# EAGLE design working (EAGLE 5.10)
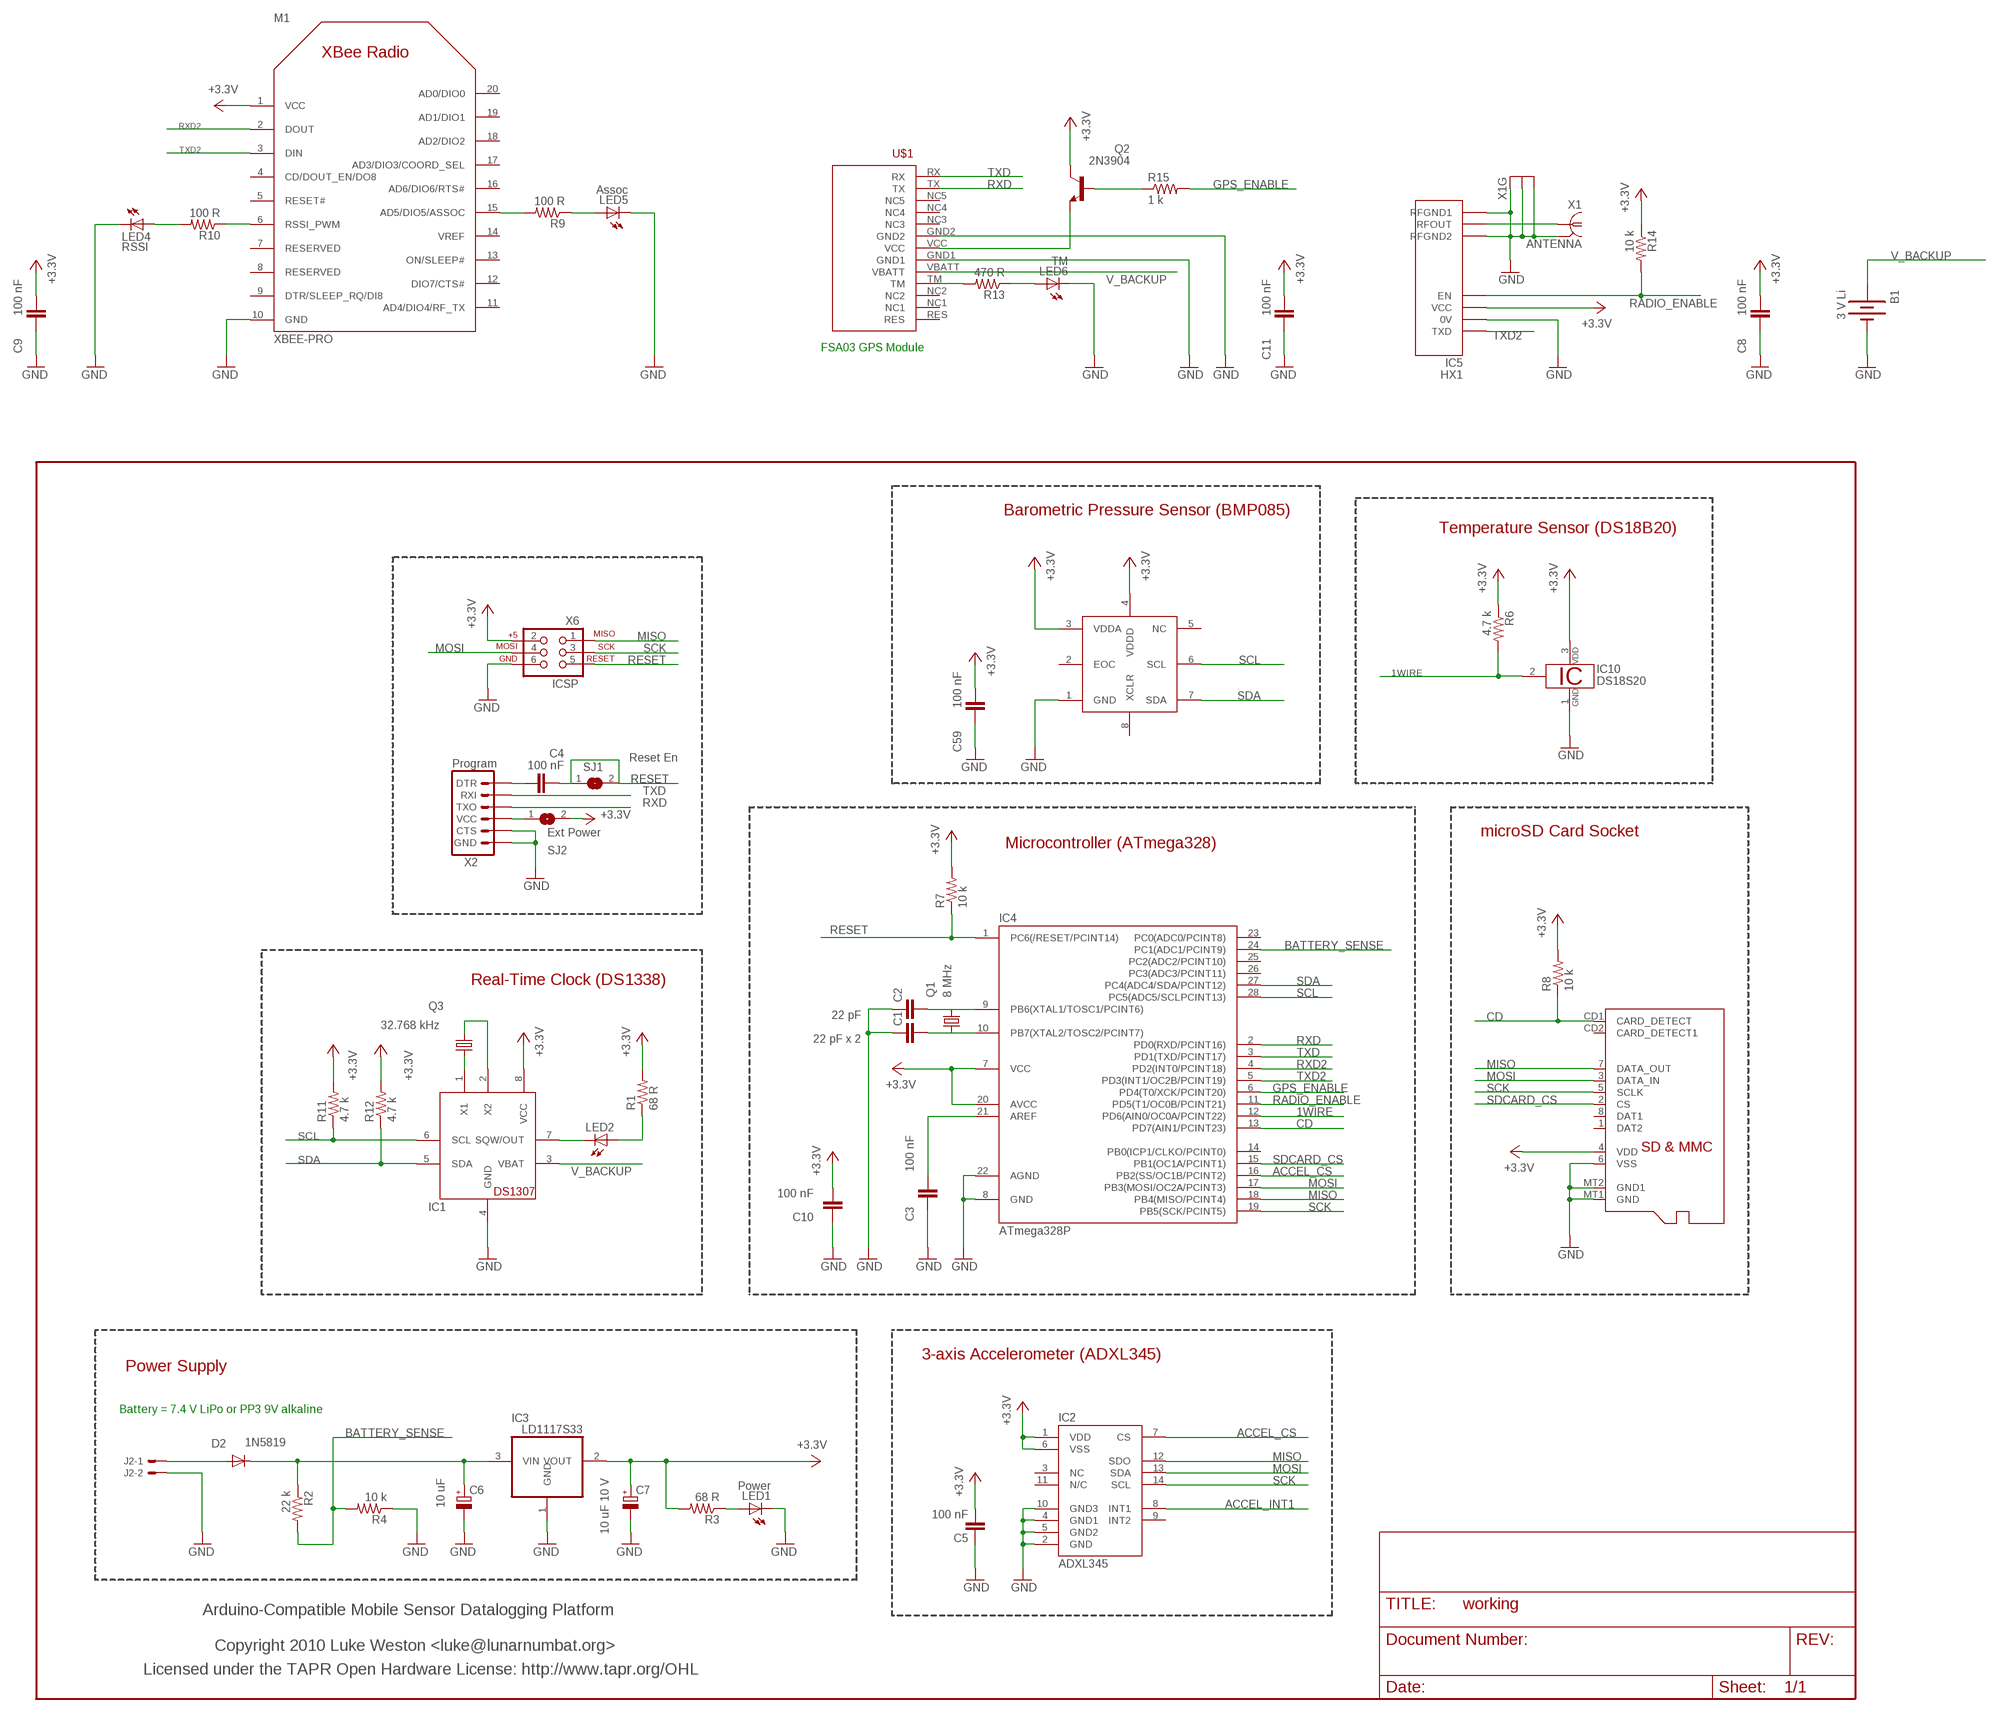
[diagram p0: schematic, sheet 1]

## Parts
B1  3 V Li  BATTERY12PTH  [BATTCON_12MM_PTH]
C1  22 pF x 2  C-EU025-024X044  [C025-024X044]
C2  22 pF  C-EU025-024X044  [C025-024X044]
C3  100 nF  C-EU025-025X050  [C025-025X050]
C4  100 nF  C-EU025-025X050  [C025-025X050]
C5  100 nF  C-EU025-025X050  [C025-025X050]
C6  10 uF  CPOL-EUE2.5-7  [E2,5-7]
C7  10 uF 10 V  CPOL-EUE2.5-7  [E2,5-7]
C8  100 nF  C-EU025-025X050  [C025-025X050]
C9  100 nF  C-EU025-025X050  [C025-025X050]
C10  100 nF  C-EU025-025X050  [C025-025X050]
C11  100 nF  C-EU025-025X050  [C025-025X050]
C59  100 nF  C-EU025-025X050  [C025-025X050]
D2  1N5819  DIODE-DO35-10  [DO35-10]
IC1  DS1338  DS1307  [DIL08]
IC2  ADXL345  [LGA14]
IC3  LD1117S33  REG1117  [SOT223]
IC4  ATmega328P  ATMEGA48/88/168-PU  [DIL28-3]
IC5  HX1  [HX1]
IC6  BMP085  [BMP085]
IC10  DS18S20  [TO92-]
J2  22-23-2021  [22-23-2021]
LED1  Power  LED3MM  [LED3MM]
LED2  LED3MM  [LED3MM]
LED4  RSSI  LED3MM  [LED3MM]
LED5  Assoc  LED3MM  [LED3MM]
LED6  TM  LED3MM  [LED3MM]
M1  XBEE-PRO  [XBEE-PRO]
Q1  8 MHz  CRYSTALHC49UV  [HC49U-V]
Q2  2N3904  [TO92]
Q3  32.768 kHz  CRYSTALTC38H  [TC38H]
R1  68 R  R-US_FLIPFLOP  [0805-THM]
R2  22 k  R-US_FLIPFLOP  [0805-THM]
R3  68 R  R-US_FLIPFLOP  [0805-THM]
R4  10 k  R-US_FLIPFLOP  [0805-THM]
R6  4.7 k  R-US_FLIPFLOP  [0805-THM]
R7  10 k  R-US_FLIPFLOP  [0805-THM]
R8  10 k  R-US_FLIPFLOP  [0805-THM]
R9  100 R  R-US_FLIPFLOP  [0805-THM]
R10  100 R  R-US_FLIPFLOP  [0805-THM]
R11  4.7 k  R-US_FLIPFLOP  [0805-THM]
R12  4.7 k  R-US_FLIPFLOP  [0805-THM]
R13  470 R  R-US_FLIPFLOP  [0805-THM]
R14  10 k  R-US_FLIPFLOP  [0805-THM]
R15  1 k  R-US_0207/2V  [0207/2V]
SJ1  Reset En  SJ  [SJ]
SJ2  Ext Power  SJ  [SJ]
U$1  FSA03  [FSA03]
U$2  MICROSD  [MICROSD]
X1  ANTENNA  LTI-SASF54GT  [LTI-SASF54GT]
X2  Program  ARDUINO_SERIAL_PROGRAMLONGPADS  [1X06_LONGPADS]
X6  ICSP  AVR_SPI_PRG_6PTH  [2X3]

## Nets
1WIRE: IC4.12(PD6(AIN0/OC0A/PCINT22)) IC10.2 R6.2
+3V3: C5.2 C7.+ C8.2 C9.2 C10.2 C11.2 C59.2 IC1.8(VCC) IC2.1(VDD) IC2.6(VSS) IC3.2(VOUT) IC4.7(VCC) IC4.20(AVCC) IC5.VCC IC6.3(VDDA) IC6.4(VDDD) IC10.3 M1.1(VCC) Q2.1(C) R1.2 R3.2 R6.1 R7.2 R8.2 R11.2 R12.2 R14.1 SJ2.2 U$2.4(VDD) X6.2 ; supply symbol labelled +3.3V
ACCEL_CS: IC2.7(CS) IC4.16(PB2(SS/OC1B/PCINT2))
ACCEL_INT1: IC2.8(INT1)
BATTERY_SENSE: IC4.24(PC1(ADC1/PCINT9)) R2.2 R4.2
CD: IC4.13(PD7(AIN1/PCINT23)) R8.1 U$2.CD1(CARD_DETECT)
GND: B1.GND(-) C1.1 C2.1 C3.1 C5.1 C6.- C7.- C8.1 C9.1 C10.1 C11.1 C59.1 IC1.4(GND) IC2.2(GND) IC2.4(GND1) IC2.5(GND2) IC2.10(GND3) IC3.1(GND) IC4.8(GND) IC4.22(AGND) IC5.0V IC5.RFGND1 IC5.RFGND2 IC6.1(GND) IC10.1 J2.2 LED1.K(C) LED4.K(C) LED5.K(C) M1.10(GND) R4.1 U$2.6(VSS) U$2.MT1(GND) U$2.MT2(GND1) X1.2(GND) X1.3(GND) X1.4(GND) X1.5(GND) X2.5(CTS) X2.6(GND) X6.6
GPS_ENABLE: IC4.6(PD4(T0/XCK/PCINT20)) R15.2
MISO: IC2.12(SDO) IC4.18(PB4(MISO/PCINT4)) U$2.7(DATA_OUT) X6.1
MOSI: IC2.13(SDA) IC4.17(PB3(MOSI/OC2A/PCINT3)) U$2.3(DATA_IN) X6.4
N$1: C2.2 IC4.9(PB6(XTAL1/TOSC1/PCINT6)) Q1.2
N$2: C1.2 IC4.10(PB7(XTAL2/TOSC2/PCINT7)) Q1.1
N$3: C3.2 IC4.21(AREF)
N$4: C4.2 X2.1(DTR)
N$5: Q2.3(E) U$1.VCC
N$6: C6.+ D2.C IC3.3(VIN) R2.1
N$7: SJ2.1 X2.4(VCC)
N$8: LED1.A R3.1
N$9: D2.A J2.1
N$10: IC1.2(X2) Q3.1
N$11: IC1.1(X1) Q3.2
N$12: IC1.7(SQW/OUT) LED2.K(C)
N$13: LED2.A R1.1
N$14: R13.2 U$1.TM
N$15: IC5.RFOUT X1.1
N$16: M1.15(AD5/DIO5/ASSOC) R9.2
N$17: Q2.2(B) R15.1
N$19: M1.6(RSSI_PWM) R10.1
N$20: LED6.A R13.1
N$21: LED4.A R10.2
N$22: LED5.A R9.1
N$36: LED6.K(C) U$1.GND1 U$1.GND2 ; supply symbol labelled GND
RADIO_ENABLE: IC4.11(PD5(T1/OC0B/PCINT21)) IC5.EN R14.2
RESET: C4.1 IC4.1(PC6(/RESET/PCINT14)) R7.1 SJ1.1 SJ1.2 X6.5
RXD: IC4.2(PD0(RXD/PCINT16)) U$1.TX X2.3(TXO)
RXD2: IC4.4(PD2(INT0/PCINT18)) M1.2(DOUT)
SCK: IC2.14(SCL) IC4.19(PB5(SCK/PCINT5)) U$2.5(SCLK) X6.3
SCL: IC1.6(SCL) IC4.28(PC5(ADC5/SCLPCINT13)) IC6.6(SCL) R11.1
SDA: IC1.5(SDA) IC4.27(PC4(ADC4/SDA/PCINT12)) IC6.7(SDA) R12.1
SDCARD_CS: IC4.15(PB1(OC1A/PCINT1)) U$2.2(CS)
TXD: IC4.3(PD1(TXD/PCINT17)) U$1.RX X2.2(RXI)
TXD2: IC4.5(PD3(INT1/OC2B/PCINT19)) IC5.TXD M1.3(DIN)
V_BACKUP: B1.VCC@1(+) IC1.3(VBAT) U$1.VBATT
Unconnected: IC2.3(NC) IC2.9(INT2) IC2.11(N/C) IC4.14(PB0(ICP1/CLKO/PCINT0)) IC4.23(PC0(ADC0/PCINT8)) IC4.25(PC2(ADC2/PCINT10)) IC4.26(PC3(ADC3/PCINT11)) IC6.2(EOC) IC6.5(NC) IC6.8(XCLR) M1.4(CD/DOUT_EN/DO8) M1.5(RESET#) M1.7(RESERVED) M1.8(RESERVED) M1.9(DTR/SLEEP_RQ/DI8) M1.11(AD4/DIO4/RF_TX) M1.12(DIO7/CTS#) M1.13(ON/SLEEP#) M1.14(VREF) M1.16(AD6/DIO6/RTS#) M1.17(AD3/DIO3/COORD_SEL) M1.18(AD2/DIO2) M1.19(AD1/DIO1) M1.20(AD0/DIO0) U$1.NC1 U$1.NC2 U$1.NC3 U$1.NC4 U$1.NC5 U$1.RES U$2.1(DAT2) U$2.8(DAT1) U$2.CD2(CARD_DETECT1)

## Notes on the sheet
- FSA03 GPS Module
- Barometric Pressure Sensor (BMP085)
- Temperature Sensor (DS18B20)
- microSD Card Socket
- Microcontroller (ATmega328)
- Real-Time Clock (DS1338)
- 3-axis Accelerometer (ADXL345)
- Power Supply
- Battery = 7.4 V LiPo or PP3 9V alkaline
- Arduino-Compatible Mobile Sensor Datalogging Platform
- Copyright 2010 Luke Weston <luke@lunarnumbat.org>
- Licensed under the TAPR Open Hardware License: http://www.tapr.org/OHL

## Library data of the parts
B1 = SparkFun:BATTERY: Battery Holders Various common sizes : AA, AAA, 20mm coin cell and 12mm coin cell.
C1-C5 C8-C11 C59 = rcl:C-EU: CAPACITOR, European symbol
C6 C7 = rcl:CPOL-EU: POLARIZED CAPACITOR, European symbol
D2 = diode:DIODE-: DIODE
IC1 = adafruit:DS1307: DS1307 Real time clock (RTC) with battery backup ability. Talk to it via i2c
IC2 = SparkFun:ADXL345
IC3 = burr-brown:REG1117: 800mA and 1A Low Dropout (LDO) Positive Regulator 1.8V, 2.5V, 2.85V, 3.3V, 5V, and Adj
IC4 = atmega8:ATMEGA48/88/168-PU
IC5 = trackuino:HX1
IC6 = SparkFun:BMP085
IC10 = 1wire:DS18S20: High Precision Digital Thermometer This chip provides a onewire thermosensor with approx. 0.5°C accuracy.A programmable over/undertemperure alarm is available. Notes: Vdd must be applied for accurate measurements at low temperatures, as the parasite power circuit otherwise heats the sensor. If parasite power is used, Vdd has to be connected to GND. The DS1822 is a low-cost thermometer chip, the DS18B20 is similar to the DS18S20, but with 9..12 Bit programmable precision. Author: Jan Kandziora <jjj@gmx.de>
J2 = con-molex:22-23-2021: .100" (2.54mm) Center Header - 2 Pin
LED1 LED2 LED4-LED6 = led:LED: LED OSRAM: - CHIPLED LG R971, LG N971, LY N971, LG Q971, LY Q971, LO R971, LY R971 LH N974, LH R974 LS Q976, LO Q976, LY Q976 LO Q996 - Hyper CHIPLED LW Q18S LB Q993, LB Q99A, LB R99A - SideLED LS A670, LO A670, LY A670, LG A670, LP A670 LB A673, LV A673, LT A673, LW A673 LH A674 LY A675 LS A676, LA A676, LO A676, LY A676, LW A676 LS A679, LY A679, LG A679 - Hyper Micro SIDELED® LS Y876, LA Y876, LO Y876, LY Y876 LT Y87S - SmartLED LW L88C, LW L88S LB L89C, LB L89S, LG L890 LS L89K, LO L89K, LY L89K LS L896, LA L896, LO L896, LY L896 - TOPLED LS T670, LO T670, LY T670, LG T670, LP T670 LSG T670, LSP T670, LSY T670, LOP T670, LYG T670 LG T671, LOG T671, LSG T671 LB T673, LV T673, LT T673, LW T673 LH T674 LS T676, LA T676, LO T676, LY T676, LB T676, LH T676, LSB T676, LW T676 LB T67C, LV T67C, LT T67C, LS T67K, LO T67K, LY T67K, LW E67C LS E67B, LA E67B, LO E67B, LY E67B, LB E67C, LV E67C, LT E67C LW T67C LS T679, LY T679, LG T679 LS T770, LO T770, LY T770, LG T770, LP T770 LB T773, LV T773, LT T773, LW T773 LH T774 LS E675, LA E675, LY E675, LS T675 LS T776, LA T776, LO T776, LY T776, LB T776 LHGB T686 LT T68C, LB T68C - Hyper Mini TOPLED® LB M676 - Mini TOPLED Santana® LG M470 LS M47K, LO M47K, LY M47K Source: http://www.osram.convergy.de - LUMILED® LXK2-PW12-R00, LXK2-PW12-S00, LXK2-PW14-U00, LXK2-PW14-V00 LXK2-PM12-R00, LXK2-PM12-S00, LXK2-PM14-U00 LXK2-PE12-Q00, LXK2-PE12-R00, LXK2-PE12-S00, LXK2-PE14-T00, LXK2-PE14-U00 LXK2-PB12-K00, LXK2-PB12-L00, LXK2-PB12-M00, LXK2-PB14-N00, LXK2-PB14-P00, LXK2-PB14-Q00 LXK2-PR12-L00, LXK2-PR12-M00, LXK2-PR14-Q00, LXK2-PR14-R00 LXK2-PD12-Q00, LXK2-PD12-R00, LXK2-PD12-S00 LXK2-PH12-R00, LXK2-PH12-S00 LXK2-PL12-P00, LXK2-PL12-Q00, LXK2-PL12-R00 Source: www.luxeon.com
M1 = xbee_r1:XBEE
Q1 = SparkFun:CRYSTAL: Crystals Various standard crystals. Proven footprints. Spark Fun Electronics SKU : COM-00534
Q2 = transistor:2N3904: NPN TRANSISTOR
Q3 = crystal:CRYSTAL: CRYSTAL
R1-R4 R6-R15 = adafruit:R-US_: RESISTOR, American symbol
SJ1 SJ2 = jumper:SJ: SMD solder JUMPER
U$1 = FSA03:FSA03: Falcom FSA03 surface mount GPS with ublox chipset, part created by Landon Cox, ESawdust.com
U$2 = adafruit:MICROSD: Micro-SD / Transflash card holder with SPI pinout For the 3M # 2908-05WB-MG and/or 4UCON #19656 push-push type
X1 = con-coax:LTI-SASF54GT: SMA vertical PCB thrue hole jack Source: Lighthorse Technologies, inc. SASF54GT.pdf
X2 = SparkFun:ARDUINO_SERIAL_PROGRAM
X6 = SparkFun:AVR_SPI_PRG_6: AVR ISP 6 Pin This is the reduced ISP connector for AVR programming. Common on Arduino. This footprint will take up less PCB space and can be used with a 10-pin to 6-pin adapter such as SKU: BOB-08508

## Net classes
1 vcc: width 0.254 mm

## Board
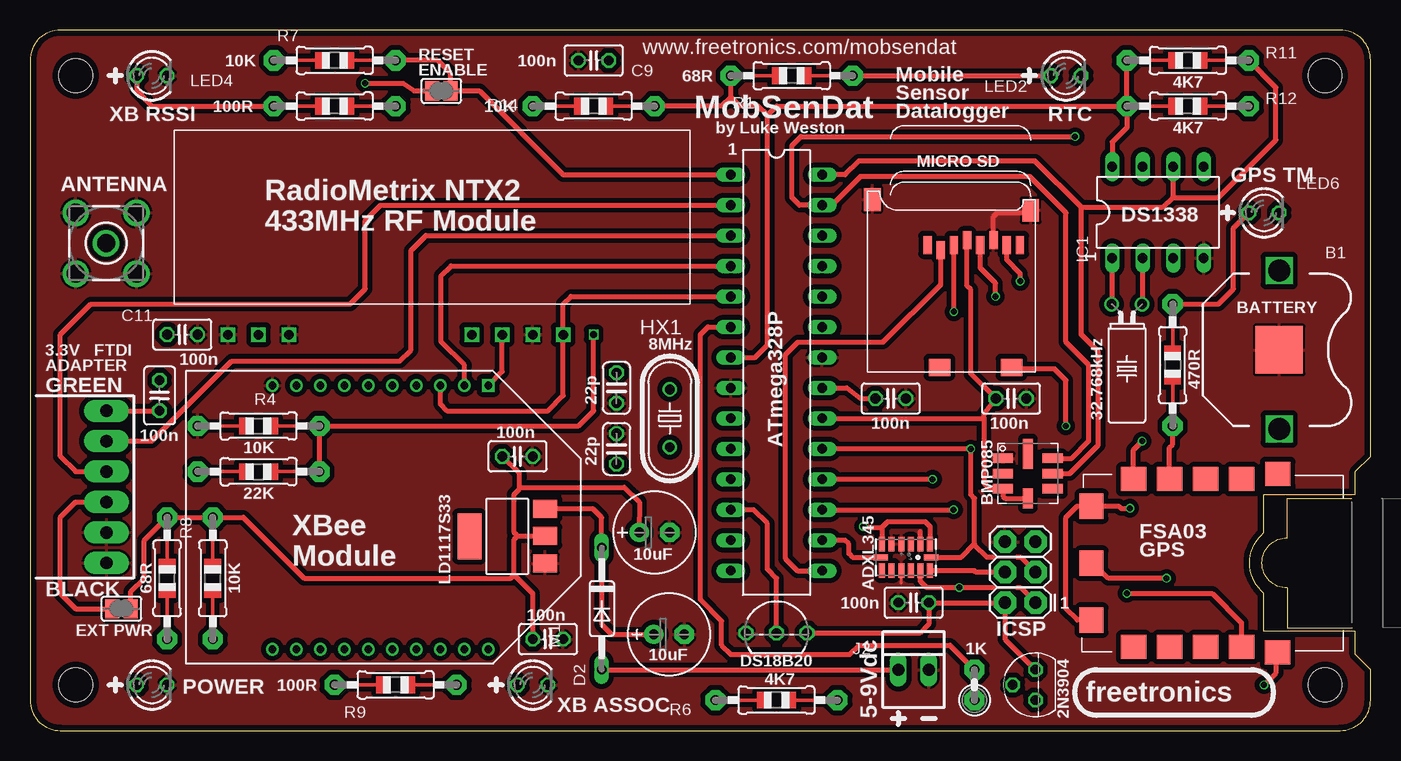
[diagram p1: board, top side]
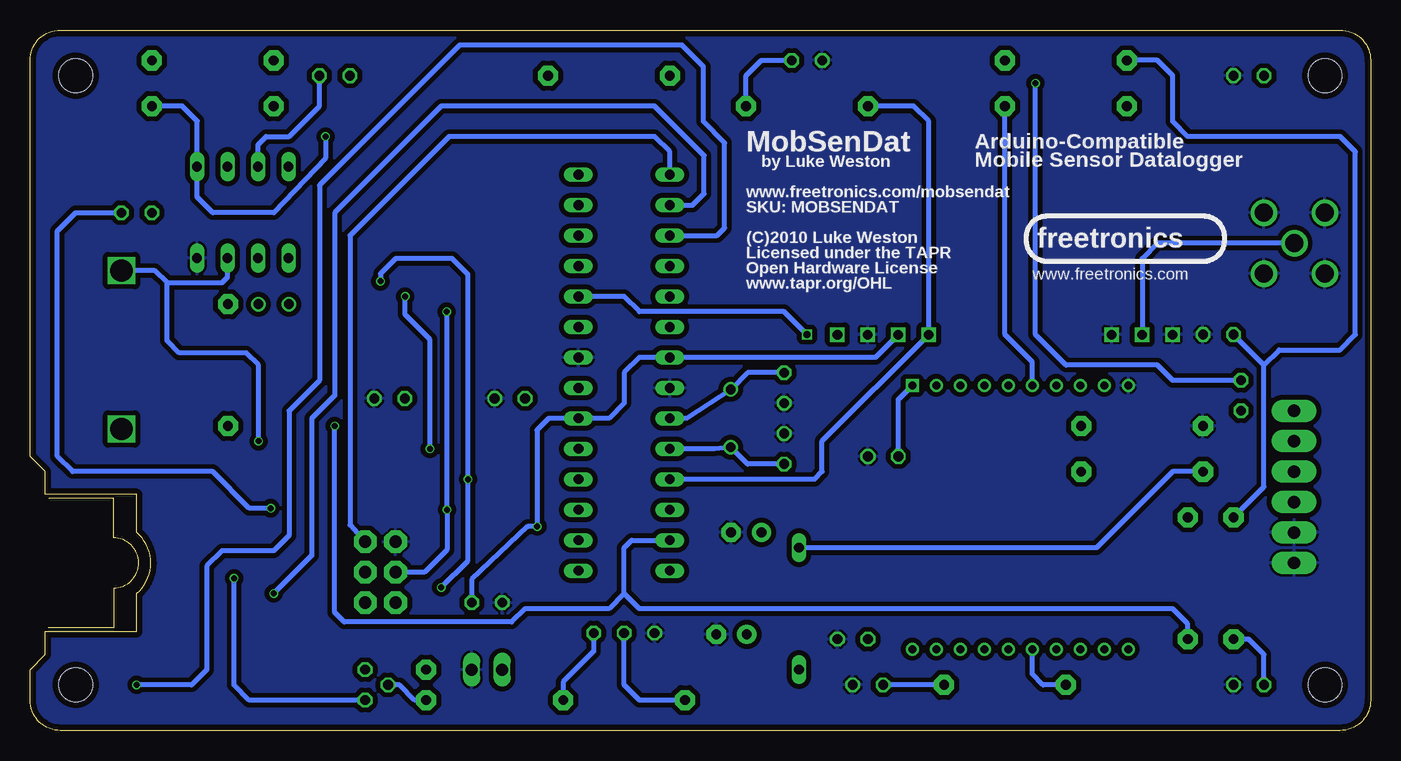
[diagram p2: board, bottom side, seen from below]

Size 111.76 x 58.42 mm. Coordinates in mm from the lower left corner, seen from the top.
Outline: 2.54,0 109.22,0 arc90 111.76,2.54 111.76,5.08 110.49,6.35 110.49,8.26 102.87,8.26 102.87,11.43 arc-100 102.87,16.51 102.87,19.68 110.49,19.68 110.49,21.59 111.76,22.86 111.76,55.88 arc90 109.22,58.42 2.54,58.42 arc90 0,55.88 0,2.54 arc90 2.54,0
Copper layers (1*16): Top 0.035mm / dielectric 1.5mm / Bottom 0.035mm
Design rules "PCBCart-.3mmHoles-.1mmAnnulars": minimum track width 8mil, minimum drill 0.3mm, track to track 8mil, track to pad 8mil, pad to pad 8mil, via to via 8mil, smd to smd 8mil, copper to edge 20mil, drill to drill 8mil, minimum pad ring 8mil, minimum via ring 4mil, stop-mask expansion 3mil, vias tented up to drill 0mil, thermal gap 8mil
Holes 2.8 mm at 3.81,54.61 3.81,3.81 107.95,3.81 107.95,54.61

### Footprints (pad centres in the part's own frame; a part is rotated, then mirrored left to right if it is on the bottom)
BATTCON_12MM_PTH = smd 3.962 x 3.962: GND 0,0 | drill 1.854 square: VCC@1 -6.604,0; VCC@2 6.604,0
C025-024X044 = drill 0.813 octagon: 1 -1.27,0; 2 1.27,0
C025-025X050 = drill 0.813 octagon: 1 -1.27,0; 2 1.27,0
E2,5-7 = drill 0.813 pad 1.6 round: + -1.27,0 | drill 0.813 pad 1.6 octagon: - 1.27,0
DO35-10 = drill 0.813 long: A 5.08,0; C -5.08,0
DIL08 = drill 0.813 long: 1 -3.81,-3.81; 2 -1.27,-3.81; 3 1.27,-3.81; 4 3.81,-3.81; 5 3.81,3.81; 6 1.27,3.81; 7 -1.27,3.81; 8 -3.81,3.81
LGA14 = smd 0.5 x 1.2: 1 2,1.1; 2 1.2,1.1; 3 0.4,1.1; 4 -0.4,1.1; 5 -1.2,1.1; 6 -2,1.1; 8 -2,-1.1; 9 -1.2,-1.1; 10 -0.4,-1.1; 11 0.4,-1.1; 12 1.2,-1.1; 13 2,-1.1 | smd 1.2 x 0.5: 7 -2.1,0; 14 2.1,0
SOT223 = smd 1.499 x 2.007: 1 -2.261,-3.15; 2 0.025,-3.15; 3 2.311,-3.15 | smd 3.81 x 2.007: 4 0,3.15
DIL28-3 = drill 0.813 long: 1 -16.51,-3.81; 2 -13.97,-3.81; 3 -11.43,-3.81; 4 -8.89,-3.81; 5 -6.35,-3.81; 6 -3.81,-3.81; 7 -1.27,-3.81; 8 1.27,-3.81; 9 3.81,-3.81; 10 6.35,-3.81; 11 8.89,-3.81; 12 11.43,-3.81; 13 13.97,-3.81; 14 16.51,-3.81; 15 16.51,3.81; 16 13.97,3.81; 17 11.43,3.81; 18 8.89,3.81; 19 6.35,3.81; 20 3.81,3.81; 21 1.27,3.81; 22 -1.27,3.81; 23 -3.81,3.81; 24 -6.35,3.81; 25 -8.89,3.81; 26 -11.43,3.81; 27 -13.97,3.81; 28 -16.51,3.81
HX1 = drill 0.8 square: 0V 25.4,-8.89; EN 20.32,-8.89; RFGND1 0,-8.89; RFGND2 5.08,-8.89; RFOUT 2.54,-8.89; TXD 27.94,-8.89; VCC 22.86,-8.89
BMP085 = smd 1.67 x 0.8: 1 -2.065,1.27; 2 -2.065,0; 3 -2.065,-1.27; 5 2.065,-1.27; 6 2.065,0; 7 2.065,1.27 | smd 0.8 x 1.67: 4 0,-2.065 | smd 0.8 x 2.5: 8 0,1.65
TO92- = drill 0.813 octagon: 1 -2.54,0; 2 0,0; 3 2.54,0
22-23-2021 = drill 1 long: 1 -1.27,0; 2 1.27,0
LED3MM = drill 0.813 octagon: A -1.27,0; K 1.27,0
XBEE-PRO = drill 0.66 square: 1 -11,9 | drill 0.66 round: 2 -11,7; 3 -11,5; 4 -11,3; 5 -11,1; 6 -11,-1; 7 -11,-3; 8 -11,-5; 9 -11,-7; 10 -11,-9; 11 11,-9; 12 11,-7; 13 11,-5; 14 11,-3; 15 11,-1; 16 11,1; 17 11,3; 18 11,5; 19 11,7; 20 11,9
HC49U-V = drill 0.813 round: 1 -2.413,0; 2 2.413,0
TO92 = drill 0.813 octagon: 1 1.27,0; 2 0,1.905; 3 -1.27,0
TC38H = drill 0.813 round: 1 -1.27,0; 2 1.27,0
0805-THM = drill 0.813 pad 1.676 octagon: 1 -5.08,0; 2 5.08,0
0207/2V = drill 0.813 pad 1.676 octagon: 1 -1.27,0; 2 1.27,0
SJ = smd 1.168 x 1.6: 1 -0.762,0; 2 0.762,0
FSA03 = smd 2.1 x 2: GND1 -4.75,-6.5; GND2 4.75,-6.5; VCC 0,-6.5 | smd 2 x 2.1: NC1 -7,6; NC2 -7,3; NC3 7,-3; NC4 7,0; NC5 7,3; RES -7.43,9.025; RX 7.454,9; TM -7,0; TX 7,6; VBATT -7,-3
MICROSD = smd 0.7 x 1.5: 1 9,-10.64; 2 7.9,-10.24; 3 6.8,-10.64; 4 5.7,-11.04; 5 4.6,-10.64; 6 3.5,-11.04; 7 2.4,-10.64; 8 1.3,-10.64 | smd 1.8 x 1.4: CD1 2,-0.44; CD2 8,-0.44 | smd 1.4 x 1.9: MT1 0.4,-13.54; MT2 13.6,-14.44
LTI-SASF54GT = drill 1.5 pad 2.2 round: 1 0,0; 2 -2.54,2.54; 3 2.54,2.54; 4 2.54,-2.54; 5 -2.54,-2.54
1X06_LONGPADS = drill 1.016 pad 1.88 long: 1 0,0; 2 2.54,0; 3 5.08,0; 4 7.62,0; 5 10.16,0; 6 12.7,0
2X3 = drill 1.016 pad 1.88 octagon: 1 0,0; 2 0,2.54; 3 2.54,0; 4 2.54,2.54; 5 5.08,0; 6 5.08,2.54

### Placement (x,y rotation side)
B1  104.14,31.75 270 top
C1  48.89,23.5 270 top
C2  48.89,28.57 90 top
C3  71.76,27.69 180 top
C4  10.8,27.94 270 top
C5  73.66,10.67 0 top
C6  53.27,8.03 0 top
C7  52.06,16.52 0 top
C8  43.18,7.62 180 top
C9  46.99,55.88 0 top
C10  40.64,22.86 180 top
C11  12.7,33.02 180 top
C59  81.79,27.69 180 top
D2  47.67,10.17 270 top
IC1  94.03,43.21 0 top
IC2  73.03,14.45 0 top
IC3  39.78,16.19 90 top
IC4  62.23,29.84 270 top
IC5  16.51,41.91 0 top
IC6  83.19,21.43 0 top
IC10  62.23,8.13 0 top
J2  73.66,5.08 0 top
LED1  10.16,3.81 0 top
LED2  86.36,54.61 0 top
LED4  10.16,54.61 0 top
LED5  41.91,3.81 0 top
LED6  102.87,43.18 0 top
M1  29.21,17.78 270 top
Q1  53.34,26.04 90 top
Q2  83.82,3.81 90 top
Q3  91.44,35.56 180 top
R1  63.5,54.61 180 top
R2  19.05,21.59 0 top
R3  11.43,12.7 90 top
R4  19.05,25.4 0 top
R6  62.23,2.54 180 top
R7  25.4,55.88 180 top
R8  15.24,12.7 90 top
R9  30.48,3.81 180 top
R10  25.4,52.07 180 top
R11  96.52,55.88 180 top
R12  96.52,52.07 180 top
R13  95.25,30.48 270 top
R14  46.99,52.07 180 top
R15  78.74,3.81 90 top
SJ1  34.29,53.34 0 top
SJ2  7.62,10.16 0 top
U$1  95,13.97 270 top
U$2  83.82,29.84 180 top
X1  6.35,40.64 0 top
X2  6.38,26.67 270 top
X6  83.82,10.67 90 top

### Tracks (layer width: path | path; a pad name or v marks a point on that pad's centre or on a via)
1WIRE
  Top 0.406: IC4.12 60.32,18.41 61.47,17.27 61.47,13.46 62.23,12.7 IC10.2
  Bottom 0.406: IC10.2 62.23,3.81 60.96,2.54 R6.2
+3V3  (via drill 0.5)
  Top 0.254: 78.11,40.87 U$2.4
  Top 0.305: IC6.4 | 40.8,20.16 40.94,20.29 | SJ2.2 8.41,10.19
  Top 0.406: IC4.20 79.53,26.04 | IC2.1 75.03,17.02 74.61,17.43 71.5,17.43 71.03,16.95 | 71.03,16.95 IC2.6 | 78.11,40.87 78.11,37.08 78.42,36.77 78.42,29.75 C59.2 79.5,26.42 79.53,26.38 79.53,26.04 | 40.94,20.29 49.56,20.29 50.8,19.05 C7.+ | 40.65,16.21 IC3.2 | 40.65,16.21 40.36,16.51 40.36,19.71 40.8,20.16 40.8,21.43 C10.2 | 40.36,12.98 40.36,15.92 40.65,16.21 | R12.2 R11.2 | 61.47,51.31 61.47,32.13 60.45,31.11 IC4.7 | R12.2 62.23,52.07 61.47,51.31 | 8.41,10.19 8.41,11.59 9.53,12.7 9.53,15.88 R3.2 R8.2 17.78,17.78 22.86,12.7 40.07,12.7 40.36,12.98 | IC6.4 81.28,19.37 81.12,19.53 IC6.3 80.01,20.16 79.53,20.64 79.53,26.04 | C8.2 41.91,11.43 40.36,12.98 | R14.1 57.66,52.07 58.42,52.83 | 71.03,16.95 69.91,16.95 v69.47,17.02 | IC5.VCC 39.37,29.94 M1.1 | IC10.3 74.17,8.13 74.93,8.89 C5.2 X6.2 81.28,7.62 Q2.1 | 58.42,52.83 R1.2 | 58.42,52.83 59.18,52.07 60.71,52.07 61.47,51.31 | IC1.8 90.22,49.07 91.44,50.29 R12.2
  Bottom 0.406: IC5.VCC 41.27,31.11 IC4.7 60.96,31.11 62.23,29.84 62.23,27.3 63.5,26.04 IC4.20 68.52,26.04 69.5,25.05 v69.47,17.02 70.26,17.02 74.93,12.61 C5.2 | IC10.3 64.77,6.6 67.31,4.06 R6.1 | R7.2 17.78,55.88 16.51,54.61 16.51,50.8 15.24,49.53 2.54,49.53 1.27,48.26 1.27,33.02 2.54,31.75 7.62,31.75 8.89,30.48 | 8.89,30.48 8.89,20.32 R3.2 | 8.89,30.48 C11.2 | R14.1 52.07,54.61 50.8,55.88 C9.2 | C7.+ | M1.1 39.37,27.62 C10.2
ACCEL_CS
  Top 0.406: IC2.7 68.58,14.45 68.26,14.76 68.26,15.56 67.95,15.88 IC4.16
BATTERY_SENSE  (via drill 0.6)
  Top 0.406: R2.2 R4.2 45.72,25.4 46.99,26.67 v46.99,33.02
  Bottom 0.406: IC4.24 62.23,36.2 60.96,34.92 48.89,34.92 v46.99,33.02
CD  (via drill 0.5)
  Top 0.254: 81.94,30.16 U$2.CD1
  Top 0.406: 81.94,30.16 85.41,30.16 86.36,29.21 v86.36,25.4
  Bottom 0.406: v86.36,25.4 86.36,9.84 85.57,9.05 71.6,9.05 70.48,10.16 63.5,10.16 62.23,11.43 | R8.1 15.24,8.89 16.51,10.16 60.96,10.16 62.23,11.43 | IC4.13 61.59,15.88 62.23,15.24 62.23,11.43
GND
  Top 0.254: 72.62,12.3 IC2.10 | 83.22,43.18 U$2.MT1
  Top 0.406: IC2.2 74.23,16.58 | 83.22,43.18 80.65,43.18 80.32,42.85 U$2.6
  pour Bottom (isolate 0.406): 0,58.42 111.76,58.42 111.76,0 0,0
  pour Top (isolate 0.406): 0,58.42 111.76,58.42 111.76,0 0,0
GPS_ENABLE
  Top 0.406: R15.2 76.71,7.11 69.09,7.11 68.33,6.35 58.42,6.35 57.66,7.11 57.66,9.14 55.88,10.92 55.88,33.02 56.52,33.66 IC4.6
MISO  (via drill 0.5)
  Top 0.254: 80.26,11.94 82.3,11.94
  Top 0.406: IC2.12 74.23,12.45 74.74,11.94 v77.47,11.94 80.26,11.94 | U$2.7 81.42,39.26 82.55,38.13 v82.55,37.47 | v75.25,20.95 IC4.18 | X6.1 82.55,11.94 82.3,11.94
  Bottom 0.406: v77.47,11.94 75.25,14.16 v75.25,20.95 75.25,38.04 76.58,39.37 81.28,39.37 82.55,38.1 v82.55,37.47
MOSI  (via drill 0.5)
  Top 0.254: 75.04,13.34 IC2.13
  Top 0.406: v77.02,34.92 U$2.3 | IC4.17 v76.99,18.41 | 75.04,13.34 78.74,13.34 78.87,13.21 X6.4
  Bottom 0.406: v77.02,34.92 76.99,34.9 v76.99,18.41 76.99,15.08 78.87,13.21 X6.4
N$1
  Bottom 0.406: IC4.9 57.02,26.04 Q1.2 51.94,29.84 C2.2
N$2
  Bottom 0.406: IC4.10 54.74,23.5 Q1.1 51.94,22.23 C1.2
N$3
  Top 0.406: IC4.21 68.1,28.57 69.25,27.69 C3.2
N$4
  Top 0.305: C4.2
  Top 0.406: X2.1 C4.2
N$5  (via drill 0.5)
  Top 0.406: v94.74,12.7 89.92,12.7 88.65,13.97 U$1.VCC
  Bottom 0.406: Q2.3 93.47,2.54 94.74,3.81 v94.74,12.7
N$6
  Top 0.305: D2.C
  Top 0.406: IC3.3 46.93,18.5 47.67,17.77 D2.C | C6.+ 48.5,8.03 47.66,8.87 D2.C
  Bottom 0.305: 47.66,15.24 D2.C
  Bottom 0.406: 47.66,15.24 22.86,15.24 16.51,21.59 R2.1
N$7
  Top 0.406: SJ2.1 3.81,10.16 2.54,11.43 2.54,17.78 3.81,19.05 X2.4
N$8
  Bottom 0.406: LED1.A 8.89,6.35 10.16,7.62 R3.1
N$9
  Top 0.305: D2.A
  Top 0.406: D2.A J2.1
N$10
  Top 0.305: Q3.1 92.76,35.61
  Top 0.406: 92.76,35.61 IC1.2
N$11
  Top 0.305: Q3.2 90.22,35.61
  Top 0.406: 90.22,35.61 IC1.1
N$12
  Bottom 0.406: LED2.K 87.63,52.07 90.17,49.53 92.08,49.53 92.76,48.85 IC1.7
N$13
  Top 0.406: R1.1 LED2.A
N$14
  Top 0.305: U$1.TM 95.25,21.13
  Top 0.406: R13.2 95.25,23.88 95,23.62 U$1.TM
N$15
  Bottom 0.406: X1.1 17.78,40.64 19.05,39.37 IC5.RFOUT
N$16
  Bottom 0.406: M1.15 28.21,4.71 27.3,3.81 R9.2
N$17
  Bottom 0.406: R15.1 79.69,2.54 80.96,3.81 Q2.2
N$18
  Top 0.254: 35.05,53.34 33.53,53.34
N$19
  Bottom 0.406: M1.6 28.21,30.75 30.48,33.02 R10.1
N$20
  Top 0.406: R13.1 99.06,35.56 100.33,36.83 100.33,41.91 LED6.A
N$21
  Top 0.406: LED4.A 8.89,53.34 10.16,52.07 R10.2
N$22
  Bottom 0.406: R9.1 LED5.A
N$36  (via drill 0.5)
  Top 0.406: U$1.GND1 88.67,18.54 | U$1.GND1 87.3,18.72 86.36,17.78 86.36,10.16 87.3,9.22 U$1.GND2 | v91.69,18.54 90.93,18.54 90.75,18.72 U$1.GND1
  Bottom 0.406: LED6.K 107.95,43.18 109.47,41.66 109.47,22.86 108.2,21.59 96.52,21.59 93.47,18.54 v91.69,18.54
RADIO_ENABLE
  Bottom 0.406: IC4.11 46.35,20.95 45.72,21.59 45.72,24.13 IC5.EN 36.83,50.8 38.1,52.07 39.37,52.07 R14.2
RESET  (via drill 0.5)
  Top 0.254: SJ1.1 SJ1.2
  Top 0.406: IC4.1 44.45,46.35 37.46,53.34 SJ1.2 35.05,54.8 33.97,55.88 R7.1 | v27.94,53.98 31.11,53.98 32,53.34 SJ1.1
  Bottom 0.406: X6.5 85.09,17.14 85.09,41.27 76.84,49.53 59.69,49.53 58.42,48.26 IC4.1 | C4.1 16.51,29.21 17.78,30.48 25.4,30.48 27.94,33.02 v27.94,53.98
RXD  (via drill 0.5)
  Top 0.406: IC4.2 29.21,43.81 27.94,42.55 27.94,36.83 26.67,35.56 5.08,35.56 2.54,33.02 2.54,22.86 3.81,21.59 X2.3 | v91.44,11.43 98.55,11.43 101,8.99 U$1.TX
  Bottom 0.406: IC4.2 56.52,43.81 55.56,44.77 55.56,47.94 59.69,52.07 77.47,52.07 86.36,43.18 86.36,27.94 88.27,26.04 88.27,14.61 v91.44,11.43
RXD2
  Top 0.406: M1.2 36.21,30.46 34.29,32.38 34.29,37.94 35.08,38.73 IC4.4
SCK  (via drill 0.5)
  Top 0.254: U$2.5 | 80.26,14.48 82.3,14.48
  Top 0.406: U$2.5 79.22,38.58 80.49,37.31 v80.49,36.2 | 78.74,15.56 78.74,19.37 78.42,19.68 v78.42,23.5 IC4.19 | IC2.14 77.63,14.45 78.74,15.56 | X6.3 82.55,14.48 82.3,14.48 | 78.74,15.56 78.74,15.49 79.76,14.48 80.26,14.48
  Bottom 0.406: v78.42,23.5 78.42,32.61 80.49,34.67 v80.49,36.2
SCL
  Top 0.305: 95.25,44.45 95.3,44.5 | R11.1
  Top 0.406: IC4.28 67.95,46.35 69.09,47.5 83.79,47.5 87.63,43.66 | 87.63,43.66 87.63,33.02 89.06,31.59 89.06,23.81 86.68,21.43 IC6.6 | 87.63,43.66 94.46,43.66 95.25,44.45 99.06,44.45 103.85,49.24 103.85,53.63 R11.1 | 95.3,44.5 IC1.6
SDA  (via drill 0.5)
  Top 0.305: 66.83,43.81 IC4.27
  Top 0.406: 66.83,43.81 69.22,46.2 83.34,46.2 86.36,43.18 86.36,32.38 88.27,30.48 88.27,24.13 86.84,22.7 IC6.7 | v87.12,49.53 64.26,49.53 63.5,48.77 63.5,44.45 64.14,43.81 IC4.27
  Bottom 0.406: R12.1 99.06,52.07 97.82,50.83 IC1.5 97.84,44.5 96.52,43.18 91.44,43.18 87.12,47.75 v87.12,49.53
SDCARD_CS
  Top 0.406: U$2.2 75.92,37.19 71.12,32.38 64.01,32.38 62.99,31.37 62.99,14.31 63.97,13.34 IC4.15
TXD  (via drill 0.5)
  Top 0.406: IC4.3 33.02,41.27 31.75,40.01 31.75,31.75 30.8,30.8 16.83,30.8 10.16,24.13 X2.2 | v102.87,3.81 103.89,4.83 103.89,6.41 U$1.RX
  Bottom 0.406: IC4.3 54.48,41.27 53.85,41.91 53.85,49.02 55.63,50.8 55.63,55.37 57.4,57.15 75.95,57.15 87.63,45.47 87.63,29.21 90.17,26.67 90.17,16.26 91.44,14.99 95.76,14.99 97.03,13.72 97.03,5.08 98.3,3.81 v102.87,3.81
TXD2
  Top 0.406: M1.3 34.21,27.23 34.77,26.67 43.18,26.67 44.45,27.94 IC5.TXD 44.45,35.56 45.09,36.2 IC4.5
V_BACKUP  (via drill 0.5)
  Top 0.406: v92.71,24.13 92,23.42 U$1.VBATT
  Bottom 0.406: IC1.3 95.3,37.8 95.76,37.34 100.33,37.34 | 100.33,37.34 101.35,38.35 B1.VCC@1 | v92.71,24.13 92.71,30.48 93.73,31.5 99.31,31.5 100.33,32.51 100.33,37.34

### Text on the board
tPlace: RESET | www.freetronics.com/mobsendat | 10K | ENABLE | 100n | 68R | Mobile | 4K7 | Sensor | 100R | 10K | XB RSSI | MobSenDat | Datalogger | RTC | by Luke Weston | 4K7 | 1 | MICRO SD | GPS TM | ANTENNA | RadioMetrix NTX2 | 433MHz RF Module | DS1338 | 1 | BATTERY | 8MHz | 3.3V | FTDI | ADAPTER | 100n | GREEN | 470R | 22p | 32.768kHz | 100n | 100n | 100n | 100n | ATmega328P | 10K | 22p | 22K | BMP085 | XBee | FSA03 | Module | 10uF | GPS | LD1117S33 | ADXL345 | BLACK | 68R | 10K | 100n | 1 | 100n | EXT PWR | ICSP | 10uF | 1K | DS18B20 | 4K7 | POWER | 100R | XB ASSOC | freetronics | 5-9Vdc | 2N3904
bPlace: Arduino-Compatible | MobSenDat | Mobile Sensor Datalogger | by Luke Weston | www.freetronics.com/mobsendat | SKU: MOBSENDAT | (C)2010 Luke Weston | freetronics | Licensed under the TAPR | www.freetronics.com | Open Hardware License | www.tapr.org/OHL
tDocu: Clock | RadioMetrix NTX2 433 MHz RF module | 8 MHz | DTR | TXD | RXD | BMP085 | +3.3V | GND | GND | 10 uF | FSA03 GPS Module